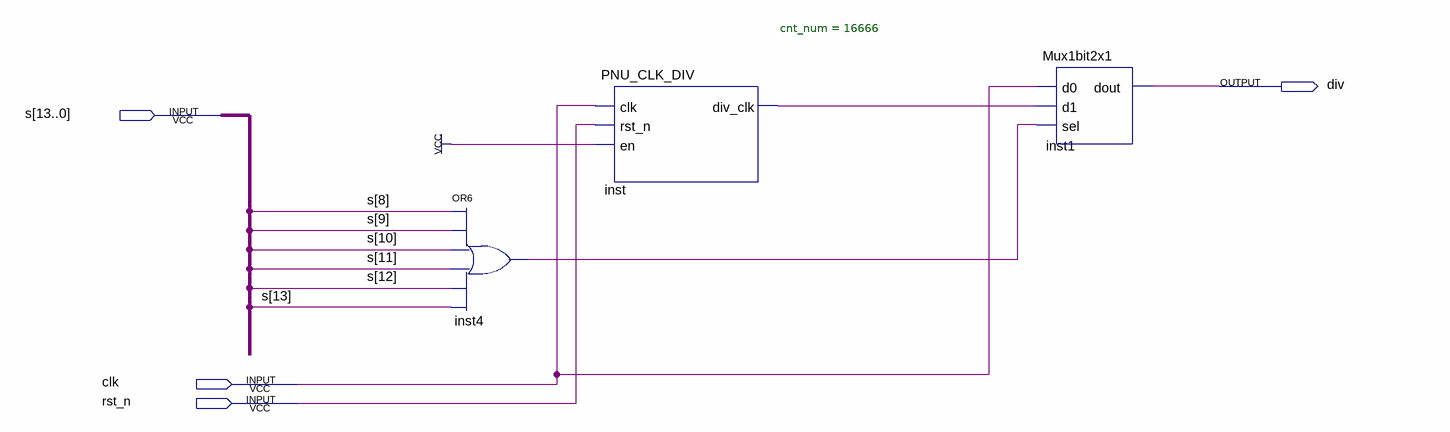
[diagram p0: schematic sheet]
// Quartus schematic clk_modifier.bdf as structural Verilog: 3 symbols, 4 pins
module clk_modifier (
  input  [13:0] s,
  input  clk,
  input  rst_n,
  output div
);

  wire inst4_out, inst_div_clk;

  or inst4 (inst4_out, s[8], s[9], s[10], s[11], s[12], s[13]);
  PNU_CLK_DIV #(.cnt_num(16666)) inst (.clk(clk), .rst_n(rst_n), .en(1'b1), .div_clk(inst_div_clk));
  Mux1bit2x1 inst1 (.d0(clk), .d1(inst_div_clk), .sel(inst4_out), .dout(div));
endmodule
